# EAGLE design Volume (EAGLE 6.5.0)
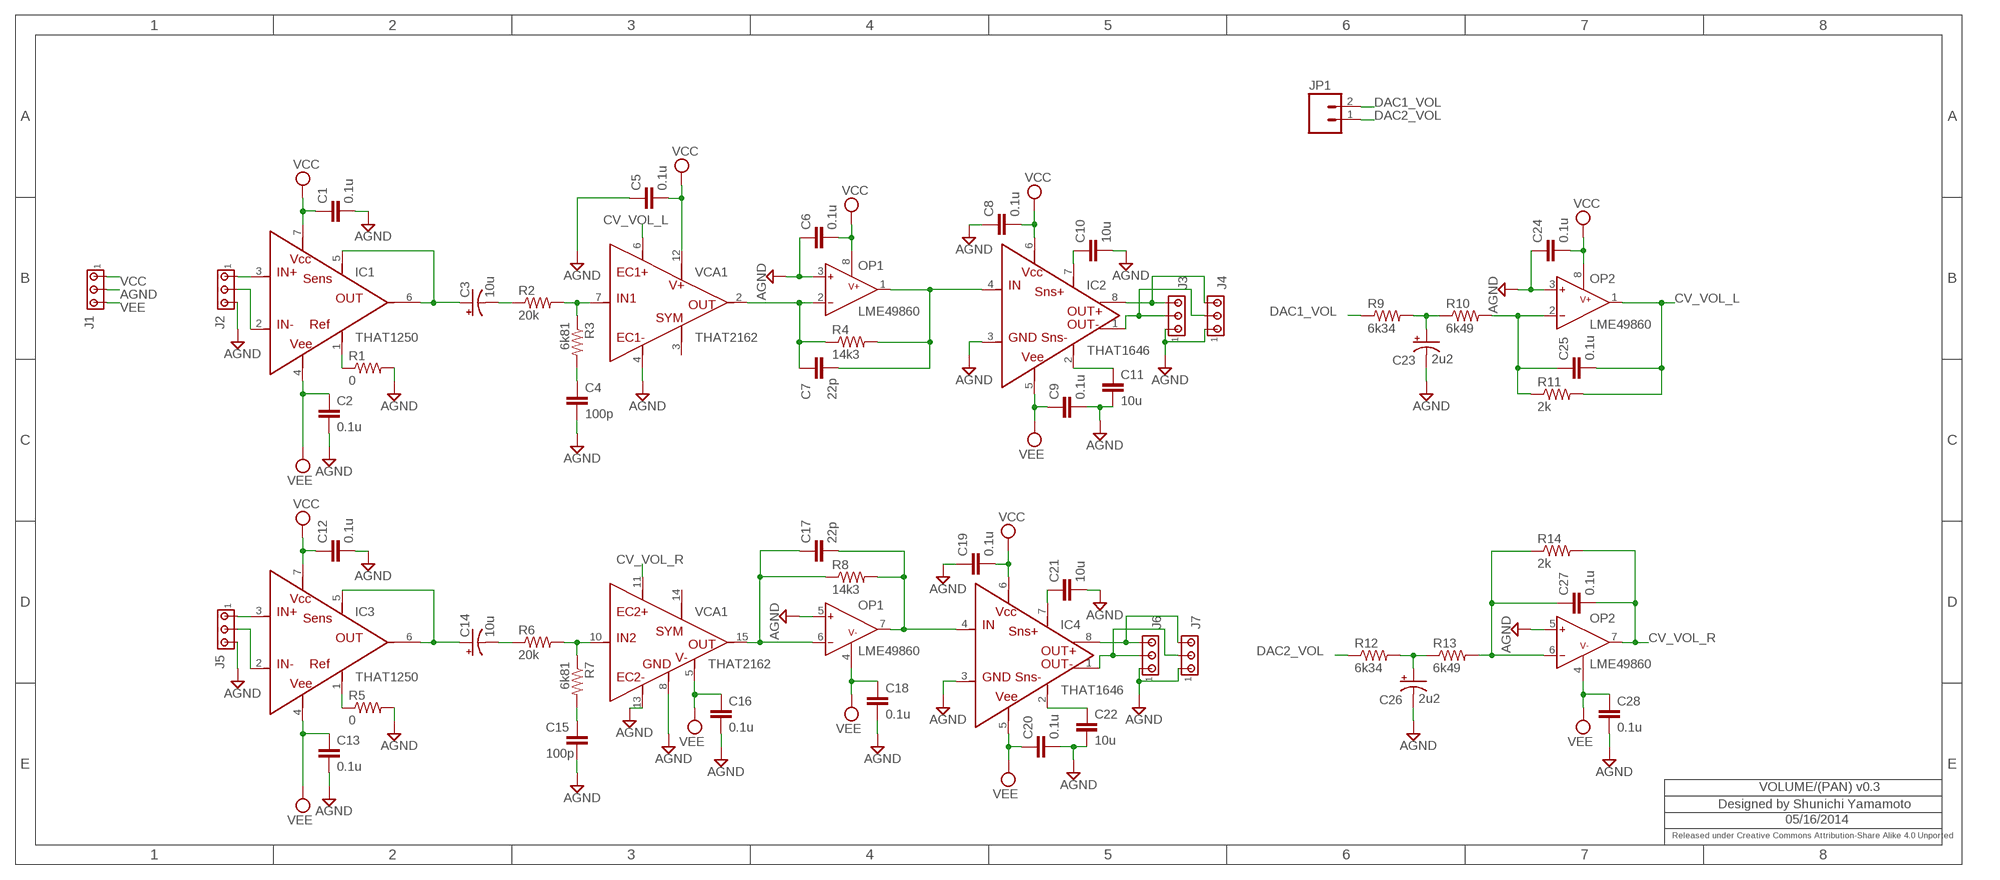
[diagram p0: schematic, sheet 1]

## Parts
C1  0.1u  C-EUC2012  [C2012]
C2  0.1u  C-EUC2012  [C2012]
C3  10u  CPOL-USUD-5X5,8  [UD-5X5,8_NICHICON]
C4  100p  C-EUC2012  [C2012]
C5  0.1u  C-EUC2012  [C2012]
C6  0.1u  C-EUC2012  [C2012]
C7  22p  C-EUC2012  [C2012]
C8  0.1u  C-EUC2012  [C2012]
C9  0.1u  C-EUC2012  [C2012]
C10  10u  C-EUC2012  [C2012]
C11  10u  C-EUC2012  [C2012]
C12  0.1u  C-EUC2012  [C2012]
C13  0.1u  C-EUC2012  [C2012]
C14  10u  CPOL-USUD-5X5,8  [UD-5X5,8_NICHICON]
C15  100p  C-EUC2012  [C2012]
C16  0.1u  C-EUC2012  [C2012]
C17  22p  C-EUC2012  [C2012]
C18  0.1u  C-EUC2012  [C2012]
C19  0.1u  C-EUC2012  [C2012]
C20  0.1u  C-EUC2012  [C2012]
C21  10u  C-EUC2012  [C2012]
C22  10u  C-EUC2012  [C2012]
C23  2u2  CPOL-USUD-5X5,8  [UD-5X5,8_NICHICON]
C24  0.1u  C-EUC2012  [C2012]
C25  0.1u  C-EUC2012  [C2012]
C26  2u2  CPOL-USUD-5X5,8  [UD-5X5,8_NICHICON]
C27  0.1u  C-EUC2012  [C2012]
C28  0.1u  C-EUC2012  [C2012]
IC1  THAT1250  [SOIC8]
IC2  THAT1646  [SOIC8]
IC3  THAT1250  [SOIC8]
IC4  THAT1646  [SOIC8]
J1  MTA03-156  [1X3MTA]
J2  MTA03-100  [10X03MTA]
J3  MTA03-100  [10X03MTA]
J4  MTA03-100  [10X03MTA]
J5  MTA03-100  [10X03MTA]
J6  MTA03-100  [10X03MTA]
J7  MTA03-100  [10X03MTA]
JP1  M02PTH  [1X02]
OP1  LME49860  [SOIC8@1]
OP2  LME49860  [SOIC8@1]
R1  0  RESISTOR0805-RES  [0805]
R2  20k  RESISTOR0805-RES  [0805]
R3  6k81  RESISTOR0805-RES  [0805]
R4  14k3  RESISTOR0805-RES  [0805]
R5  0  RESISTOR0805-RES  [0805]
R6  20k  RESISTOR0805-RES  [0805]
R7  6k81  RESISTOR0805-RES  [0805]
R8  14k3  RESISTOR0805-RES  [0805]
R9  6k34  RESISTOR0805-RES  [0805]
R10  6k49  RESISTOR0805-RES  [0805]
R11  2k  RESISTOR0805-RES  [0805]
R12  6k34  RESISTOR0805-RES  [0805]
R13  6k49  RESISTOR0805-RES  [0805]
R14  2k  RESISTOR0805-RES  [0805]
VCA1  THAT2162  [QSOP-16]

## Nets
AGND: C1.2 C2.2 C4.2 C5.1 C6.1 C8.1 C9.2 C10.2 C11.2 C12.2 C13.2 C15.2 C16.2 C18.2 C19.1 C20.2 C21.2 C22.2 C23.- C24.1 C26.- C28.2 IC2.3(GND) IC4.3(GND) J1.2 J2.3 J3.1 J4.1 J5.3 J6.1 J7.1 OP1.3(INA+) OP1.5(INB+) OP2.3(INA+) OP2.5(INB+) R1.2 R5.2 VCA1.4(EC1-) VCA1.8(GND) VCA1.13(EC2-)
C8: C14.- R6.1
CV_VOL_L: C25.2 OP2.1(OUTA) R11.2 VCA1.6(EC1+)
CV_VOL_R: C27.2 OP2.7(OUTB) R14.2 VCA1.11(EC2+)
DAC1_VOL: JP1.2 R9.1
DAC2_VOL: JP1.1 R12.1
N$1: IC1.1(REF) R1.1
N$2: C10.1 IC2.7(SNS+)
N$3: IC1.3(IN+) J2.1
N$4: IC1.2(IN-) J2.2
N$5: IC3.1(REF) R5.1
N$7: IC3.3(IN+) J5.1
N$8: IC3.2(IN-) J5.2
N$13: IC2.8(OUT+) J3.3 J4.3
N$14: IC2.1(OUT-) J3.2 J4.2
N$15: IC4.8(OUT+) J6.3 J7.3
N$16: IC4.1(OUT-) J6.2 J7.2
N$33: R2.2 R3.1 VCA1.7(IN1)
N$34: C11.1 IC2.2(SNS-)
N$35: C21.1 IC4.7(SNS+)
N$36: C22.1 IC4.2(SNS-)
N$145: C3.- R2.1
N$147: R6.2 R7.1 VCA1.10(IN2)
N$149: C7.1 OP1.2(INA-) R4.1 VCA1.2(OUT1)
N$153: C4.1 R3.2
N$154: C15.1 R7.2
N$165: C23.+ R9.2 R10.1
N$166: C25.1 OP2.2(INA-) R10.2 R11.1
N$167: C26.+ R12.2 R13.1
N$168: C27.1 OP2.6(INB-) R13.2 R14.1
N$175: C17.1 OP1.6(INB-) R8.1 VCA1.15(OUT2)
OUT_L: C7.2 IC2.4(IN) OP1.1(OUTA) R4.2
OUT_R: C17.2 IC4.4(IN) OP1.7(OUTB) R8.2
PIN_L: C3.+ IC1.5(SENS) IC1.6(OUT)
PIN_R: C14.+ IC3.5(SENS) IC3.6(OUT)
VCC: C1.1 C5.2 C6.2 C8.2 C12.1 C19.2 C24.2 IC1.7(VCC) IC2.6(VCC) IC3.7(VCC) IC4.6(VCC) J1.1 OP1.8(V+) OP2.8(V+) VCA1.12(V+)
VEE: C2.1 C9.1 C13.1 C16.1 C18.1 C20.1 C28.1 IC1.4(VEE) IC2.5(VEE) IC3.4(VEE) IC4.5(VEE) J1.3 OP1.4(V-) OP2.4(V-) VCA1.5(V-)
Unconnected: VCA1.3(SYM1) VCA1.14(SYM2)

## Notes on the sheet
- VOLUME/(PAN) v0.3
- Designed by Shunichi Yamamoto
- 05/16/2014
- Released under Creative Commons Attribution-Share Alike 4.0 Unported

## Library data of the parts
C1 C2 C4-C13 C15-C22 C24 C25 C27 C28 = rcl:C-EU: CAPACITOR, European symbol
C3 C14 C23 C26 = rcl:CPOL-US: POLARIZED CAPACITOR, American symbol
IC1 IC3 = thatcorp:THAT1250
IC2 IC4 = thatcorp:THAT1646
J1 = con-amp:MTA03-156: AMP connector
J2-J7 = con-amp:MTA03-100: AMP connector
JP1 = SparkFun:M02: Header 2 Standard 2-pin 0.1" header. Use with straight break away headers (SKU : PRT-00116), right angle break away headers (PRT-00553), swiss pins (PRT-00743), machine pins (PRT-00117), and female headers (PRT-00115). Molex polarized connector foot print use with SKU : PRT-08233 with associated crimp pins and housings.
OP1 OP2 = thatcorp:LME49860
R1-R14 = SparkFun:RESISTOR: Resistor Basic schematic elements and footprints for 0603, 1206, and PTH resistors.
VCA1 = thatcorp:THAT2162

## Board
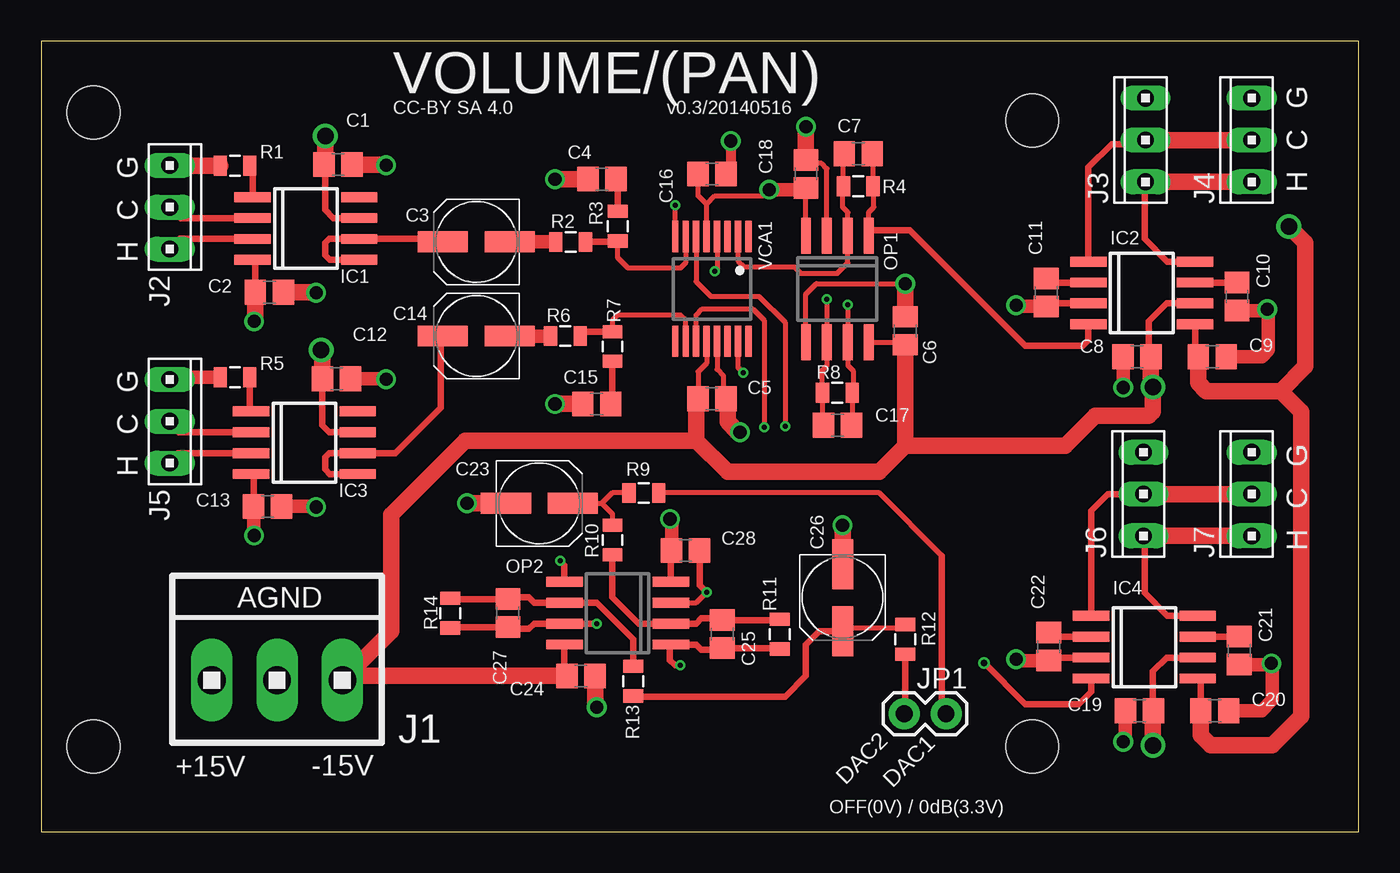
[diagram p1: board, top side]
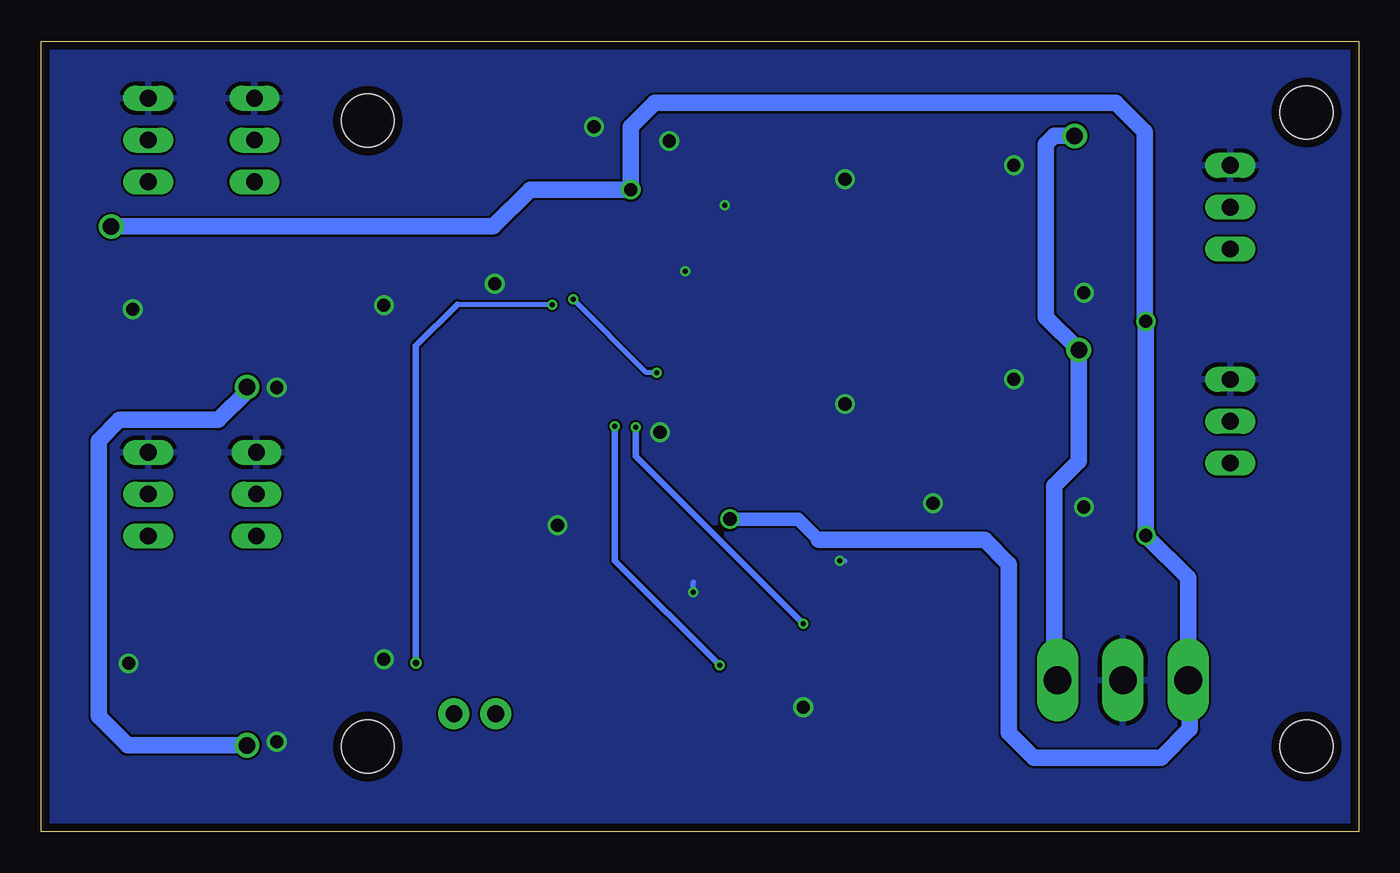
[diagram p2: board, bottom side, seen from below]

Size 80 x 48 mm. Coordinates in mm from the lower left corner, seen from the top.
Outline: 0,0 80,0 80,48 0,48 0,0
Copper layers (1*16): Top 0.035mm / dielectric 1.53mm / Bottom 0.035mm
Design rules "pban_5mil-l2": minimum track width 5mil, minimum drill 0.3mm, track to track 5mil, track to pad 0.229mm, pad to pad 5mil, via to via 5mil, smd to smd 5mil, copper to edge 0.5mm, drill to drill 0.5mm, minimum pad ring 0.15mm, minimum via ring 0.15mm, stop-mask expansion 4mil, vias tented up to drill 0.35mm, thermal gap 10mil
Holes 3.2 mm at 3.17,5.17 60.17,5.17 3.17,43.67 60.17,43.17

### Footprints (pad centres in the part's own frame; a part is rotated, then mirrored left to right if it is on the bottom)
C2012 = smd 1.3 x 1.5: 1 -0.85,0; 2 0.85,0
UD-5X5,8_NICHICON = smd 3.048 x 1.27: + 2.042,0; - -2.018,0
SOIC8 = smd 0.6 x 2.2: 1 -1.905,-3.235; 2 -0.635,-3.235; 3 0.635,-3.235; 4 1.905,-3.235; 5 1.905,3.235; 6 0.635,3.235; 7 -0.635,3.235; 8 -1.905,3.235
1X3MTA = drill 1.676 long: 1 3.937,0; 2 -0.025,0; 3 -3.988,0
10X03MTA = drill 1.016 long: 1 2.54,0; 2 0,0; 3 -2.54,0
1X02 = drill 1.016 pad 1.88: 1 0,0; 2 2.54,0
SOIC8@1 = smd 0.6 x 2.2: 1 -1.905,-3.235; 2 -0.635,-3.235; 3 0.635,-3.235; 4 1.905,-3.235; 5 1.905,3.235; 6 0.635,3.235; 7 -0.635,3.235; 8 -1.905,3.235
0805 = smd 0.8 x 1.2: 1 -0.9,0; 2 0.9,0
QSOP-16 = smd 0.381 x 1.905: 1 0.318,-0.635; 2 0.953,-0.635; 3 1.587,-0.635; 4 2.223,-0.635; 5 2.857,-0.635; 6 3.493,-0.635; 7 4.128,-0.635; 8 4.763,-0.635; 9 4.763,5.715; 10 4.128,5.715; 11 3.493,5.715; 12 2.857,5.715; 13 2.223,5.715; 14 1.587,5.715; 15 0.953,5.715; 16 0.318,5.715

### Placement (x,y rotation side)
C1  18.02,40.51 0 top
C2  13.85,32.76 0 top
C3  26.43,35.81 180 top
C4  34.05,39.62 180 top
C5  40.72,26.29 180 top
C6  52.47,30.42 270 top
C7  49.61,41.16 0 top
C8  66.52,28.84 0 top
C9  71.1,28.84 0 top
C10  72.6,32.5 270 top
C11  61.02,32.75 270 top
C12  17.93,27.51 0 top
C13  13.75,19.76 0 top
C14  26.43,30.1 180 top
C15  33.73,25.97 180 top
C16  40.72,39.94 0 top
C17  48.34,24.68 0 top
C18  46.43,39.94 90 top
C19  66.68,7.34 0 top
C20  71.25,7.34 0 top
C21  72.74,11 270 top
C22  61.17,11.25 270 top
C23  30.24,19.94 0 top
C24  32.78,9.46 180 top
C25  41.35,12 270 top
C26  48.66,14.22 270 top
C27  28.34,13.27 270 top
C28  39.13,17.08 0 top
IC1  16.07,36.63 270 top
IC2  66.82,32.71 270 top
IC3  15.98,23.63 270 top
IC4  66.98,11.21 270 top
J1  14.35,9.2 0 top
J2  7.81,37.92 270 top
J3  67.06,42 90 top
J4  73.5,42 90 top
J5  7.81,24.92 270 top
J6  66.93,20.5 90 top
J7  73.5,20.5 90 top
JP1  52.4,7.16 0 top
OP1  48.34,32.96 180 top
OP2  35,13.27 90 top
R1  11.77,40.43 180 top
R2  32.15,35.81 0 top
R3  35,36.77 90 top
R4  49.61,39.19 0 top
R5  11.77,27.59 180 top
R6  31.83,30.1 0 top
R7  34.69,29.46 270 top
R8  48.34,26.65 0 top
R9  36.59,20.57 180 top
R10  34.69,17.72 270 top
R11  44.84,12 270 top
R12  52.47,11.68 90 top
R13  35.95,9.14 90 top
R14  24.84,13.27 270 top
VCA1  43.26,35.5 180 top

### Tracks (layer width: path | path; a pad name or v marks a point on that pad's centre or on a via)
AGND  (via drill 0.3, 0.8)
  Top 0.305: VCA1.8 v38.49,38.04 | OP2.3 39.77,13.91 v40.4,14.54 | OP1.3 47.7,40.26 47.38,40.58 46.65,40.58 C18.2 | OP1.5 46.43,32.64 47.07,33.27 v52.47,33.27 | VCA1.13 41.03,28.07 41.42,27.69 41.42,26.44 C5.1 | VCA1.4 41.03,34.16 v40.91,34.04
  Top 0.406: C28.2 39.98,14.96 v40.4,14.54 | OP2.5 31.77,16.19 v31.51,16.45 | IC2.3 61.2,32.08 C11.2 | IC4.3 61.35,10.58 C22.2
  Top 0.61: v41.86,41.94 41.86,40.23 C16.2
  Top 0.813: R5.2 7.81,27.59 J5.3 | C13.2 16.66,19.76 v16.69,19.72 | C12.2 20.91,27.51 v20.94,27.47 | C10.2 74.37,31.65 v74.44,31.72 74.5,31.66 74.5,29.25 74.09,28.84 C9.2 | v65.69,26.97 65.69,28.82 C8.1 | C21.2 74.62,10.15 v74.69,10.22 74.75,10.16 74.75,8 74.09,7.34 C20.2 | C22.2 59.27,10.4 v59.19,10.47 | C19.1 65.83,5.61 v65.69,5.47 | C11.2 59.27,31.9 v59.19,31.97
  Top 1.016: C4.2 v31.19,39.62 | C15.2 v31.19,25.97 | C18.2 v46.43,42.8 | C6.1 v52.47,33.27 | C23.- v25.86,19.94 | C26.- v48.66,18.61 | C24.1 33.63,7.66 v33.73,7.56 | v42.43,24.26 42.3,24.26 41.67,24.89 41.67,26.19 C5.1 | R1.2 7.83,40.43 J2.3 | C2.2 16.66,32.76 v16.69,32.72 | C1.2 20.91,40.51 v20.94,40.47
  Bottom 0.305: v40.4,14.54 40.4,15.18 | v31.51,16.45 31.19,16.45
  pour Bottom: -0.07,48.2 -0.07,-0.06 80.04,-0.06 80.04,48.2
C8
  Top 0.813: C14.- R6.1
CV_VOL_L  (via drill 0.3)
  Top 0.305: v45.16,24.61 45.16,30.92 43.58,32.51 40.65,32.51 39.77,33.4 VCA1.6 | 38.18,11.31 OP2.1
  Top 0.406: OP2.1 39.77,11.37 40.08,11.05 41.57,11.05 C25.2 44.48,11.15 R11.2 | v38.81,10.1 38.49,10.1 38.18,10.41 38.18,11.31
  Bottom 0.406: v45.16,24.61 45.16,16.45 v38.81,10.1
CV_VOL_R  (via drill 0.3)
  Top 0.305: v43.89,24.57 43.89,31.05 43.19,31.75 40.15,31.75 39.77,31.37 VCA1.11
  Top 0.406: v33.73,12.64 OP2.7 29.92,12.64 29.61,12.32 28.44,12.32 C27.2 24.89,12.42 R14.2
  Bottom 0.406: v43.89,24.57 43.89,22.8 v33.73,12.64
DAC1_VOL
  Top 0.305: 54.69,16.76 50.88,20.57 R9.1
  Top 0.406: 54.69,16.76 54.69,7.41 JP1.2
DAC2_VOL
  Top 0.406: R12.1 52.47,7.23 JP1.1
N$1
  Top 0.406: IC1.1 12.84,40.27 R1.1
N$2
  Top 0.406: IC2.7 C10.1
N$3
  Top 0.406: IC1.3 8.41,35.99 J2.1
N$4
  Top 0.406: IC1.2 8.47,37.26 J2.2
N$5
  Top 0.406: R5.1 12.67,25.61 IC3.1
N$7
  Top 0.406: IC3.3 8.29,22.99 J5.1
N$8
  Top 0.406: IC3.2 8.34,24.26 J5.2
N$13
  Top 0.406: IC2.8 68.38,34.62 67,36 67,39.32 J3.3
  Top 1.016: J4.3 J3.3
N$14
  Top 0.406: IC2.1 63.59,40.34 65,41.75 66.89,41.75 J3.2
  Top 1.016: J4.2 J3.2
N$15
  Top 0.406: IC4.8 68.38,13.12 67,14.5 67,18.05 J6.3
  Top 1.016: J7.3 J6.3
N$16
  Top 0.406: IC4.1 63.74,19.49 64.75,20.5 J6.2
  Top 1.016: J7.2 J6.2
N$33
  Top 0.305: VCA1.7 39.13,34.54 38.81,34.23 35.64,34.23 35,34.86 R3.1
  Top 0.406: R2.2 34.95,35.81 R3.1
N$34
  Top 0.406: IC2.2 61.27,33.35 C11.1
N$35
  Top 0.406: IC4.7 C21.1
N$36
  Top 0.406: IC4.2 61.42,11.85 C22.1
N$145
  Top 0.813: C3.- R2.1
N$147
  Top 0.305: VCA1.10 39.13,31.05 38.81,31.37 35,31.37 34.69,31.05 R7.1
  Top 0.406: R7.1 32.99,30.36 R6.2
N$149
  Top 0.305: C7.1 48.71,41.11 R4.1 48.66,39.14 48.66,37.92 48.97,37.6 OP1.2 48.97,34.54 48.34,33.91 46.12,33.91 45.73,34.29 42.69,34.29 42.3,34.67 VCA1.2
N$153
  Top 0.406: R3.2 35,39.52 C4.1
N$154
  Top 0.406: R7.2 34.69,26.07 C15.1
N$165
  Top 0.305: C23.+ 34.05,19.94 | 34.05,19.94 34.69,19.3 R10.1 | R9.2 34.69,20.57 34.05,19.94
N$166
  Top 0.406: R10.2 34.69,14.22 36.27,12.64 OP2.2 39.77,12.64 40.08,12.95 41.57,12.95 C25.1 44.48,12.85 R11.1
N$167
  Top 0.305: 48.85,12.37 52.25,12.37 R12.2
  Top 0.406: 48.85,12.37 C26.+ 47.24,12.17 46.43,11.37 46.43,9.46 45.16,8.19 36.01,8.19 R13.1
N$168
  Top 0.406: R13.2 35.95,11.68 33.73,13.91 OP2.6 29.92,13.91 29.61,14.22 28.44,14.22 C27.1 24.89,14.12 R14.1
N$175  (via drill 0.3)
  Top 0.305: C17.1 47.44,24.73 R8.1 47.38,26.71 47.38,27.99 47.7,28.31 OP1.6 v47.7,32.32 | VCA1.15 42.3,28.19 v42.62,27.88
  Bottom 0.305: v42.62,27.88 43.26,27.88 v47.7,32.32
OUT_L
  Top 0.305: OP1.1 50.24,36.77 | 50.24,36.77 50.24,37.6 50.56,37.92 50.56,39.14 R4.2 50.51,41.11 C7.2 | 50.5,36.51 50.24,36.77
  Top 0.406: 50.5,36.51 52.74,36.51 59.75,29.5 63.25,29.5 63.59,29.84 IC2.4
OUT_R  (via drill 0.3, 0.4)
  Top 0.305: C17.2 49.24,24.73 R8.2 49.29,26.71 49.29,27.99 48.97,28.31 OP1.7 v48.97,32
  Top 0.406: IC4.4 63.74,8.49 63,7.75 59.75,7.75 v57.25,10.25
  Bottom 0.305: v48.97,32 54.75,32
  Bottom 0.406: v57.25,10.25 57.25,29.5 54.75,32
PIN_L
  Top 0.406: IC1.5 17.53,34.72 17.25,35 17.25,35.75 17.49,35.99 IC1.6 24.21,35.99 C3.+
PIN_R
  Top 0.406: IC3.5 17.53,21.72 17.25,22 17.25,22.75 17.49,22.99 IC3.6 21.49,22.99 24.25,25.75 24.25,29.96 C14.+
VCC  (via drill 1)
  Top 0.305: OP1.8 52.31,29.72 C6.2 | 31.77,9.62 C24.2 | VCA1.12 40.4,28.45 39.89,27.94 39.89,26.31 C5.2
  Top 0.406: OP2.8 31.77,9.62 | IC1.7 17.74,37.26 17.25,37.75 17.25,40.43 C1.1 | C12.1 17.08,24.67 17.5,24.25 IC3.7 | IC2.6 68.33,32.08 67.25,31 67.25,28.97 C8.2 | IC4.6 68.33,10.58 67.5,9.75 67.5,7.37 C19.2
  Top 0.813: 39.77,26.19 C5.2
  Top 1.016: C6.2 52.47,23.43 | 52.47,23.43 50.88,21.84 41.67,21.84 39.77,23.75 | 39.77,23.75 39.77,26.19 | C12.1 17.08,29.17 v17,29.25 | 17.25,40.43 v17.25,42.25 | C24.2 18.54,9.46 J1.1 21.25,12.17 21.25,19.25 25.75,23.75 39.77,23.75 | 67.5,7.37 v67.5,5.25 | C8.2 67.37,27.13 v67.5,27 67.5,25.5 67.25,25.25 64,25.25 62.18,23.43 52.47,23.43
  Bottom 1.016: J1.1 18.5,9.42 18.5,21 17,22.5 v17,29.25 19,31.25 19,41.75 18.5,42.25 v17.25,42.25 | v67.5,5.25 74.75,5.25 76.5,7 76.5,23.75 75.25,25 69.25,25 67.5,26.75 v67.5,27
VEE  (via drill 0.8, 1)
  Top 0.305: OP1.4 C18.1 | 38.24,17.04 C28.1 | VCA1.5 40.4,38.1 | 40.4,38.1 39.89,38.61 39.89,39.92 C16.1 | 40.4,38.1 40.91,38.61 43.83,38.61 v44.21,38.99
  Top 0.406: OP2.4 38.24,17.04 | C2.1 13,34.56 IC1.4 | C13.1 12.9,21.56 IC3.4 | IC2.5 70.06,29.04 C9.1 | C20.1 70.4,9.12 IC4.5
  Top 0.813: v44.21,38.99 46.33,38.99 C18.1 | C28.1 38.28,18.88 v38.18,18.99 | C13.1 12.9,18.01 v12.93,17.99
  Top 1.016: C2.1 13,31.06 v12.93,30.99 | C9.1 70.25,27.25 70.75,26.75 75.25,26.75 | 75.25,26.75 76.75,28.25 76.75,35.75 v75.75,36.75 | C20.1 70.4,5.85 71,5.25 74.75,5.25 76.5,7 76.5,25.5 75.25,26.75
  Bottom 0.813: v38.18,18.99 34.05,18.99 32.78,17.72
  Bottom 1.016: 32.78,17.72 22.72,17.72 21.25,16.25 21.25,6 19.75,4.5 12,4.5 10.25,6.25 10.25,9.09 J1.3 10.36,15.42 v12.93,17.99 v12.93,30.99 13,31.06 13,42.5 14.75,44.25 42.75,44.25 44.21,42.79 v44.21,38.99 50.31,38.99 52.55,36.75 v75.75,36.75

### Text on the board
tNames: VOLUME/(PAN) | CC-BY SA 4.0 | v0.3/20140516 | G | C | G | H | C | H | G | C | H | G | C | H | AGND | DAC2 | DAC1 | +15V | -15V | OFF(0V) / 0dB(3.3V)